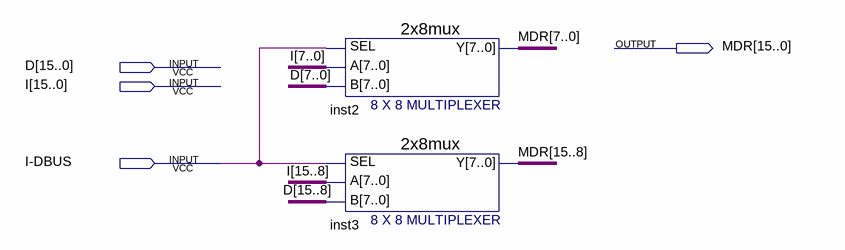
[diagram p0: schematic sheet]
// Quartus schematic Memory_MUX.bdf as structural Verilog: 2 symbols, 4 pins
module Memory_MUX (
  input  [15:0] D,
  input  [15:0] I,
  input  \I-DBUS ,
  output [15:0] MDR
);

  \2x8mux  inst2 (.SEL(\I-DBUS ), .A(I[7:0]), .B(D[7:0]), .Y(MDR[7:0]));
  \2x8mux  inst3 (.SEL(\I-DBUS ), .A(I[15:8]), .B(D[15:8]), .Y(MDR[15:8]));
endmodule
